# Altium schematic sheet B293A Connectors.SchDoc
size A4
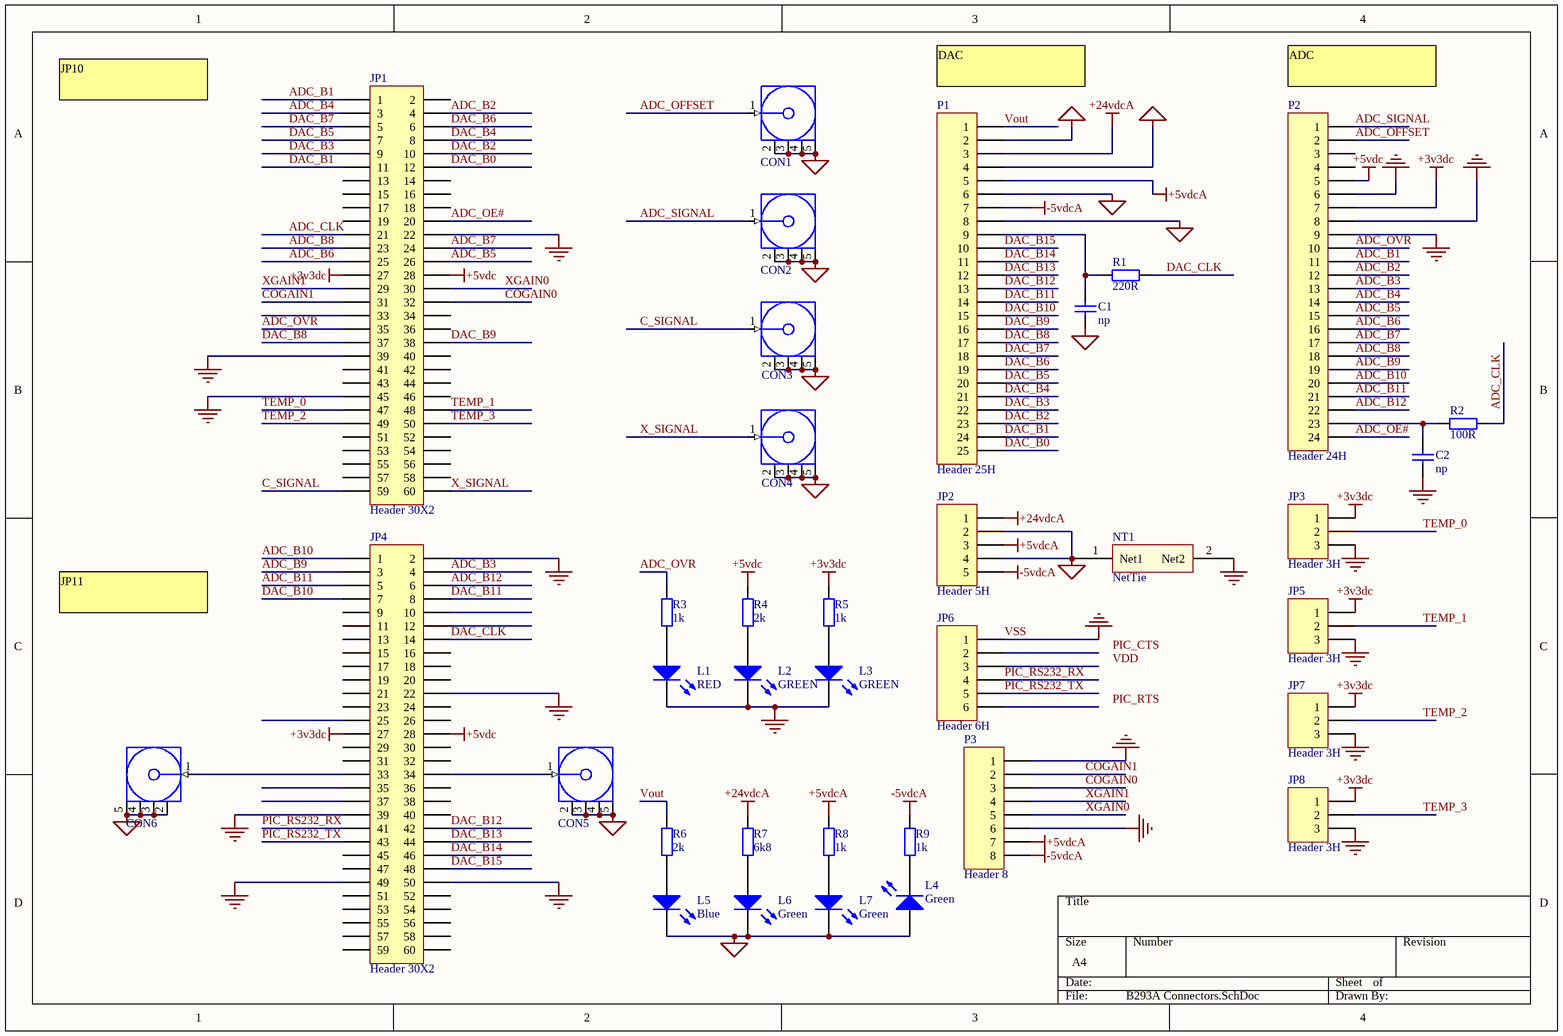
[diagram p0: B293A Connectors.SchDoc]

## Parts
C1  np  [1206]
C2  np  [1206]
CON1  SMA Vertical  [SMA Vertical]  (value not drawn)
CON2  SMA Vertical  [SMA Vertical]  (value not drawn)
CON3  SMA Vertical  [SMA Vertical]  (value not drawn)
CON4  SMA Vertical  [SMA Vertical]  (value not drawn)
CON5  SMA Vertical  [SMA Vertical]  (value not drawn)
CON6  SMA Vertical  [SMA Vertical]  (value not drawn)
JP1  Header 30X2  [HDR2X30]
JP2  Header 5H  [HDR1X5H]
JP3  Header 3H  [HDR1X3H]
JP4  Header 30X2  [HDR2X30]
JP5  Header 3H  [HDR1X3H]
JP6  Header 6H  [HDR1X6H]
JP7  Header 3H  [HDR1X3H]
JP8  Header 3H  [HDR1X3H]
L1  RED  [1206 - LED]
L2  GREEN  [1206 - LED]
L3  GREEN  [1206 - LED]
L4  Green  [1206 - LED]
L5  Blue  [1206 - LED]
L6  Green  [1206 - LED]
L7  Green  [1206 - LED]
NT1  NetTie  [NetTie]  (net tie, no BOM)
P1  Header 25H  [HDR1X25H]
P2  Header 24H  [HDR1X24H]
P3  Header 8  [HDR1X8]
R1  220R  [1206]
R2  100R  [1206]
R3  1k  [1206]
R4  2k  [1206]
R5  1k  [1206]
R6  2k  [1206]
R7  6k8  [1206]
R8  1k  [1206]
R9  1k  [1206]

## Nets
+3v3dc: JP1.27 JP3.1 JP4.27 JP5.1 JP7.1 JP8.1 P2.7 R5.2
+5vdc: JP1.28 JP4.28 P2.5 R4.2
+5vdcA: JP2.3 P1.5 P3.7 R8.2
+24vdcA: JP2.1 P1.3 R7.2
-5vdcA: JP2.5 P1.7 P3.8 R9.1
AGND: C1.2 CON1.2(GND) CON1.3(GND) CON1.4(GND) CON1.5(GND) CON2.2(GND) CON2.3(GND) CON2.4(GND) CON2.5(GND) CON3.2(GND) CON3.3(GND) CON3.4(GND) CON3.5(GND) CON4.2(GND) CON4.3(GND) CON4.4(GND) CON4.5(GND) CON5.2(GND) CON5.3(GND) CON5.4(GND) CON5.5(GND) CON6.2(GND) CON6.3(GND) CON6.4(GND) CON6.5(GND) JP2.2 JP2.4 L4.A L5.K L6.K L7.K NT1.1(Net1) P1.2 P1.4 P1.6 P1.8
VSS: C2.2 JP1.22 JP1.39 JP1.45 JP3.3 JP4.2 JP4.22 JP4.39 JP4.49 JP4.50 JP5.3 JP6.1 JP7.3 JP8.3 L1.K L2.K L3.K NT1.2(Net2) P2.6 P2.8 P2.9 P3.1 P3.6  [also labelled GND]
ADC_B1: JP1.1 P2.11
ADC_B2: JP1.4 P2.12
ADC_B3: JP4.4 P2.13
ADC_B4: JP1.3 P2.14
ADC_B5: JP1.26 P2.15
ADC_B6: JP1.25 P2.16
ADC_B7: JP1.24 P2.17
ADC_B8: JP1.23 P2.18
ADC_B9: JP4.3 P2.19
ADC_B10: JP4.1 P2.20
ADC_B11: JP4.5 P2.21
ADC_B12: JP4.6 P2.22
ADC_CLK: JP1.21 R2.2
ADC_OE#: JP1.20 P2.24
ADC_OFFSET: CON1.1(Signal) P2.2
ADC_OVR: JP1.35 P2.10 R3.2
ADC_SIGNAL: CON2.1(Signal) P2.1
C_SIGNAL: CON3.1(Signal) JP1.59
COGAIN0: JP1.32 P3.3
COGAIN1: JP1.31 P3.2
DAC_B0: JP1.12 P1.25
DAC_B1: JP1.11 P1.24
DAC_B2: JP1.10 P1.23
DAC_B3: JP1.9 P1.22
DAC_B4: JP1.8 P1.21
DAC_B5: JP1.7 P1.20
DAC_B6: JP1.6 P1.19
DAC_B7: JP1.5 P1.18
DAC_B8: JP1.37 P1.17
DAC_B9: JP1.38 P1.16
DAC_B10: JP4.7 P1.15
DAC_B11: JP4.8 P1.14
DAC_B12: JP4.42 P1.13
DAC_B13: JP4.44 P1.12
DAC_B14: JP4.46 P1.11
DAC_B15: JP4.48 P1.10
DAC_CLK: JP4.14 R1.2
PIC_RS232_RX: JP4.41 JP6.4
PIC_RS232_TX: JP4.43 JP6.5
TEMP_0: JP1.47 JP3.2
TEMP_1: JP1.48 JP5.2
TEMP_2: JP1.49 JP7.2
TEMP_3: JP1.50 JP8.2
Vout: P1.1 R6.2
X_SIGNAL: CON4.1(Signal) JP1.60
XGAIN0: JP1.30 P3.5
XGAIN1: JP1.29 P3.4
NetC1_1: C1.1 P1.9 R1.1
NetC2_1: C2.1 P2.23 R2.1
NetCON5_1: CON5.1(Signal) JP4.34
NetCON6_1: CON6.1(Signal) JP4.33
NetL1_A: L1.A R3.1
NetL2_A: L2.A R4.1
NetL3_A: L3.A R5.1
NetL4_K: L4.K R9.2
NetL5_A: L5.A R6.1
NetL6_A: L6.A R7.1
NetL7_A: L7.A R8.1

Not connected (* = marked no-connect by the designer): JP1 2 13 14 15 16 17 18 19 33 34 36 40 41 42 43 44 46 51 52 53 54 55 56 57 58; JP4 9 10 11 12 13 15 16 17 18 19 20 21 23 24 25 26 29 30 31 32 35 36 37 38 40 45 47 51 52 53 54 55 56 57 58 59 60; JP6 2 3 6; P2 3 4

## Notes on the sheet
- JP10
- (near P1) DAC
- (near P2) ADC
- JP11
- Labels drawn without touching a wire or pin: PIC_CTS, PIC_RTS, VDD

## Library data of the parts
C1 C2 = CAP: Capacitor
CON1-CON6 = SMA Vertical: Manufacturers Part No: 5-1814832-1; Order Code: 1248990; Supplier: Onecall
JP1 JP4 = Header 30X2: Header, 30-Pin, Dual row; Revision: 17-Jul-2002: Re-released for DXP Platform.; Publisher: Altium Limited
JP2 = Header 5H: Header, 5-Pin, Right Angle; Manufacturer Part Number: 70543-0007; Revision: 17-Jul-2002: Re-released for DXP Platform.; Publisher: Altium Limited; Supplier Part Number: 6792528; Supplier: RS
JP3 = Header 3H: Header, 3-Pin, Right Angle; Manufacturer Part Number: 70553-0002; Revision: 17-Jul-2002: Re-released for DXP Platform.; Publisher: Altium Limited; Supplier Part Number: 670-0844; Supplier: RS
JP5 JP7 JP8 = Header 3H: Header, 3-Pin, Right Angle; Revision: 17-Jul-2002: Re-released for DXP Platform.; Publisher: Altium Limited
JP6 = Header 6H: Header, 6-Pin, Right Angle; Revision: 17-Jul-2002: Re-released for DXP Platform.; Publisher: Altium Limited
L1-L7 = LED 1206
P1 = Header 25H: Header, 25-Pin, Right Angle; LatestRevisionDate: 17-Jul-2002; LatestRevisionNote: Re-released for DXP Platform.; Publisher: Altium Limited
P2 = Header 24H: Header, 24-Pin, Right Angle; LatestRevisionDate: 17-Jul-2002; LatestRevisionNote: Re-released for DXP Platform.; Publisher: Altium Limited
P3 = Header 8: Header, 8-Pin; Maanufacturer Part Number: 70543-0007; LatestRevisionDate: 17-Jul-2002; LatestRevisionNote: Re-released for DXP Platform.; Publisher: Altium Limited; Supplier Part Number: 6792496; Supplier: RS
R1-R9 = RES2
  R3: Supplier Part Number: 2073877; Supplier: Onecall